# EAGLE design TRV_UP20 (EAGLE 6.4)
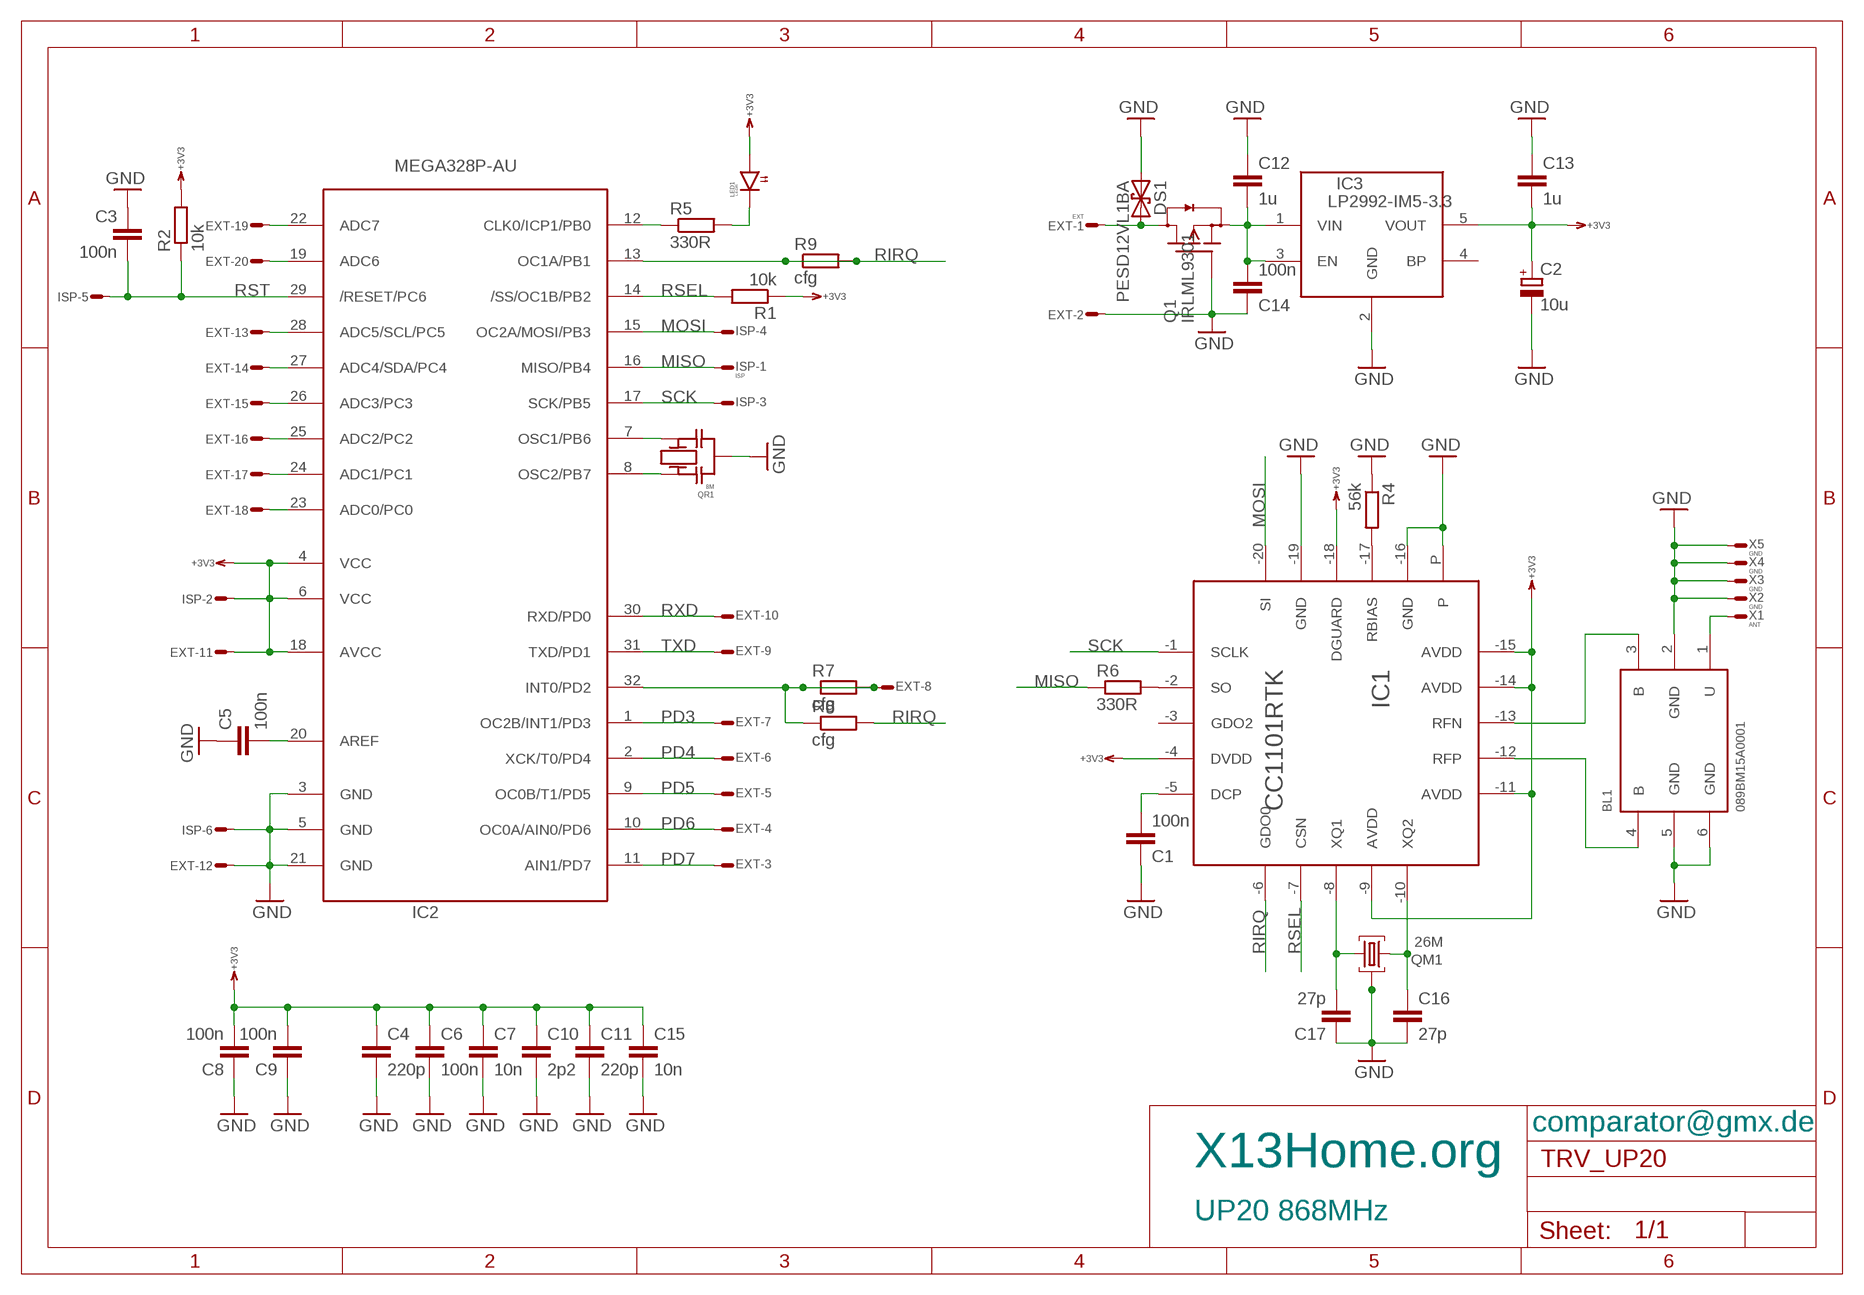
[diagram p0: schematic, sheet 1]

## Parts
BL1  089BM15A0001  BL  [BL]
C1  100n  C0402  [0402]
C2  10u  C_POLSMCB  [SMC_B]
C3  100n  C0603  [0603]
C4  220p  C0402  [0402]
C5  100n  C0603  [0603]
C6  100n  C0402  [0402]
C7  10n  C0402  [0402]
C8  100n  C0603  [0603]
C9  100n  C0603  [0603]
C10  2p2  C0402  [0402]
C11  220p  C0402  [0402]
C12  1u  C0603  [0603]
C13  1u  C0603  [0603]
C14  100n  C0603  [0603]
C15  10n  C0402  [0402]
C16  27p  C0402  [0402]
C17  27p  C0402  [0402]
DS1  PESD12VL1BA  TVS-U323  [SOD323]
EXT  EXT  ML20SE  [ML20S]
IC1  CC1101RTK  CC110L  [VQFN20]
IC2  MEGA328P-AU  MEGA168PA  [TQFP32-08]
IC3  LP2992-IM5-3.3  LDO  [SOT23-5]
ISP  ISP  ML6ES  [ML6S]
LED1  LEDR  LEDT134  [T1-3/4]
Q1  IRLML9301  FET-PDSOT23  [SOT23]
QM1  26M  QM3.2X2.5  [SMD_4P_3.2X2.5]
QR1  8M  QRCE  [CSTCE]
R1  10k  R0402  [0402]
R2  10k  R0603  [0603]
R4  56k  R0402  [0402]
R5  330R  R0402  [0402]
R6  330R  R0402  [0402]
R7  cfg  R0402  [0402]
R8  cfg  R0402  [0402]
R9  cfg  R0402  [0402]
X1  ANT  WIREPADS2.54/1.27  [S2.54/1.27]
X2  GND  WIREPADS2.54/1.27  [S2.54/1.27]
X3  GND  WIREPADS2.54/1.27  [S2.54/1.27]
X4  GND  WIREPADS2.54/1.27  [S2.54/1.27]
X5  GND  WIREPADS2.54/1.27  [S2.54/1.27]

## Nets
+3V3: C2.+ C4.1 C6.1 C7.1 C8.2 C9.2 C10.1 C11.1 C13.2 C15.1 EXT.11 IC1.-4(DVDD) IC1.-9(AVDD) IC1.-11(AVDD) IC1.-14(AVDD) IC1.-15(AVDD) IC1.-18(DGUARD) IC2.4(VCC) IC2.6(VCC) IC2.18(AVCC) IC3.5(VOUT) ISP.2 LED1.A R1.1 R2.2
ADC6: EXT.20 IC2.19(ADC6)
ADC7: EXT.19 IC2.22(ADC7)
GND: BL1.2(GND) BL1.5(GND) BL1.6(GND) C1.1 C2.- C3.1 C4.2 C5.1 C6.2 C7.2 C8.1 C9.1 C10.2 C11.2 C12.1 C13.1 C14.1 C15.2 C16.2 C17.1 DS1.A EXT.2 EXT.12 IC1.-16(GND) IC1.-19(GND) IC1.P IC2.3(GND) IC2.5(GND) IC2.21(GND) IC3.2(GND) ISP.6 Q1.1(G) QM1.2(M1) QM1.4(M2) QR1.G(M) R4.1 X2.1(S) X3.1(S) X4.1(S) X5.1(S)
MISO: IC2.16(MISO/PB4) ISP.1 R6.1
MOSI: IC1.-20(SI) IC2.15(OC2A/MOSI/PB3) ISP.4
N$1: C1.2 IC1.-5(DCP)
N$2: IC1.-17(RBIAS) R4.2
N$4: IC1.-2(SO) R6.2
N$5: DS1.C EXT.1 Q1.3(D)
N$6: C5.2 IC2.20(AREF)
N$7: IC2.8(OSC2/PB7) QR1.A
N$8: IC2.7(OSC1/PB6) QR1.B
N$10: IC2.12(CLK0/ICP1/PB0) R5.1
N$11: EXT.8 IC2.32(INT0/PD2) R7.1 R7.2 R8.1
N$12: C12.2 C14.2 IC3.1(VIN) IC3.3(EN) Q1.2(S)
N$13: BL1.3(B) IC1.-13(RFN)
N$14: BL1.4(B) IC1.-12(RFP)
N$16: BL1.1(U) X1.1(S)
N$17: C17.2 IC1.-8(XQ1) QM1.3
N$18: C16.1 IC1.-10(XQ2) QM1.1
N$21: LED1.C R5.2
PC0: EXT.18 IC2.23(ADC0/PC0)
PC1: EXT.17 IC2.24(ADC1/PC1)
PC2: EXT.16 IC2.25(ADC2/PC2)
PC3: EXT.15 IC2.26(ADC3/PC3)
PC4: EXT.14 IC2.27(ADC4/SDA/PC4)
PC5: EXT.13 IC2.28(ADC5/SCL/PC5)
PD3: EXT.7 IC2.1(OC2B/INT1/PD3)
PD4: EXT.6 IC2.2(XCK/T0/PD4)
PD5: EXT.5 IC2.9(OC0B/T1/PD5)
PD6: EXT.4 IC2.10(OC0A/AIN0/PD6)
PD7: EXT.3 IC2.11(AIN1/PD7)
RIRQ: IC1.-6(GDO0) IC2.13(OC1A/PB1) R8.2 R9.1 R9.2
RSEL: IC1.-7(CSN) IC2.14(/SS/OC1B/PB2) R1.2
RST: C3.2 IC2.29(/RESET/PC6) ISP.5 R2.1
RXD: EXT.10 IC2.30(RXD/PD0)
SCK: IC1.-1(SCLK) IC2.17(SCK/PB5) ISP.3
TXD: EXT.9 IC2.31(TXD/PD1)
Unconnected: IC1.-3(GDO2) IC3.4(BP)

## Notes on the sheet
- comparator@gmx.de
- X13Home.org
- UP20 868MHz

## Library data of the parts
BL1 = RF:BL
C1 C3-C17 = RCL:C: Capacitor SMD
C2 = RCL:C_POL: POLARIZED CAPACITOR, European symbol
DS1 = Diode:TVS-U: DIODE
EXT = Conn:ML20?E: HARTING
IC1 = RF:CC110L
IC2 = atmel:MEGA168P: MCU, 4/8/16k, TQFP32
IC3 = DCDC:LDO
ISP = Conn:ML6E: HARTING
LED1 = Optic:LED
Q1 = Transistor:FET-PD
QM1 = QUARTZ:QM
QR1 = QUARTZ:QR
R1 R2 R4-R9 = RCL:R: Resistor SMD
X1-X5 = Conn:WIREPAD: Wire PAD connect wire on PCB

## Board
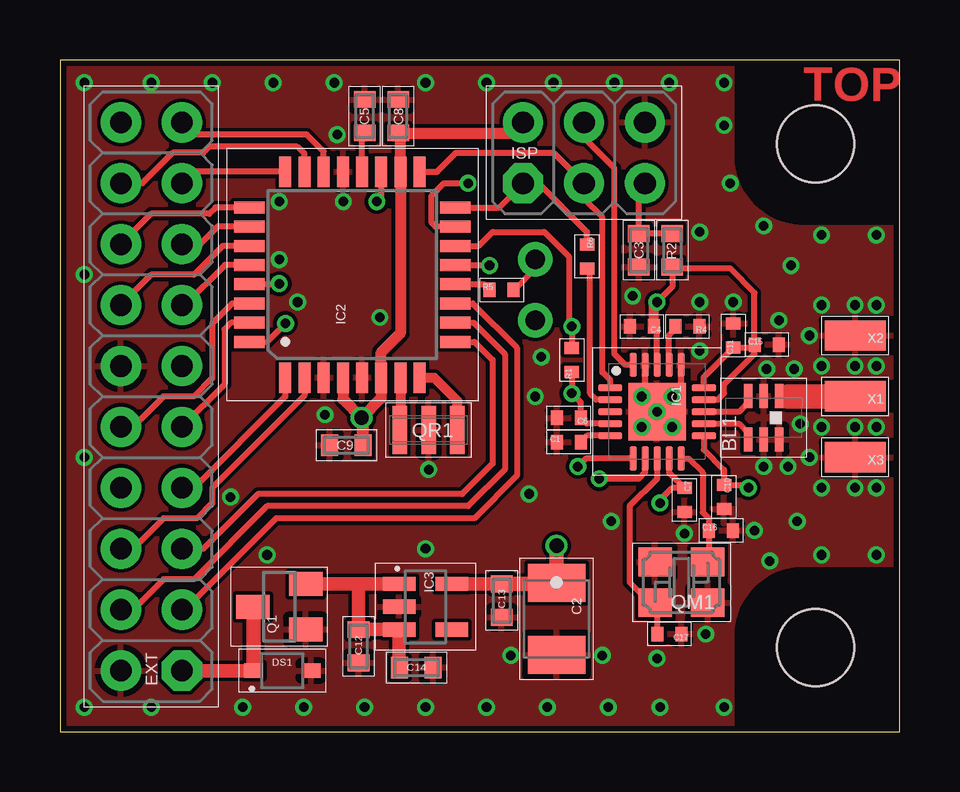
[diagram p1: board, top side]
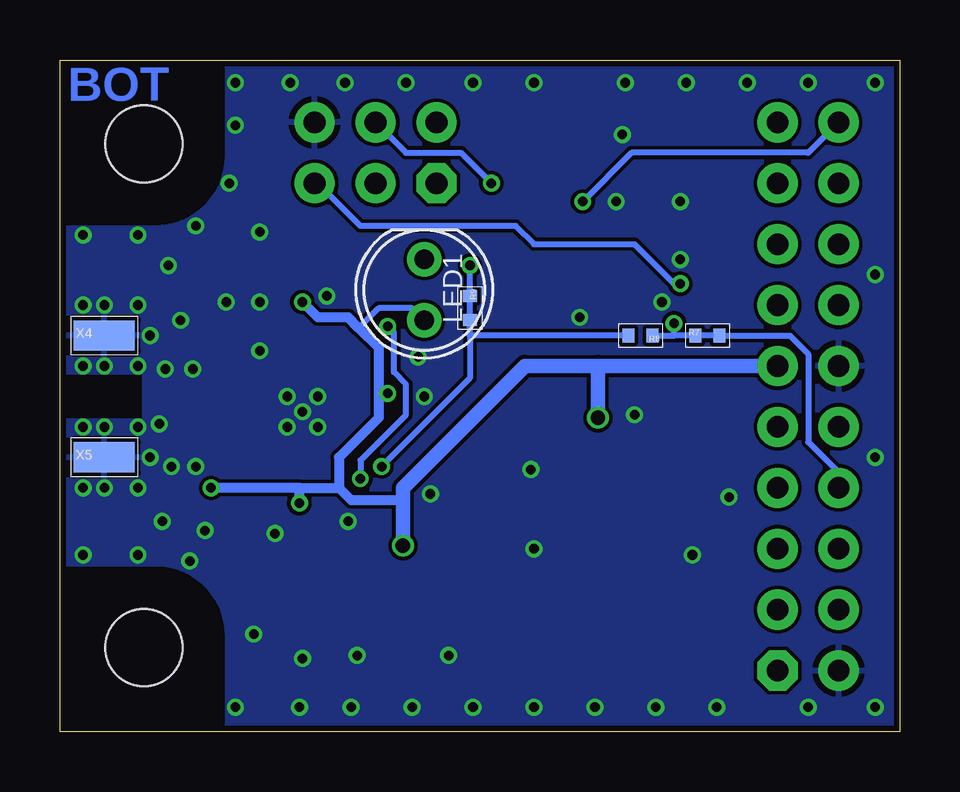
[diagram p2: board, bottom side, seen from below]

Size 35 x 28 mm. Coordinates in mm from the lower left corner, seen from the top.
Outline: 0,0 35,0 35,28 0,28 0,0
Copper layers (1*16): Top 0.035mm / dielectric 1.5mm / Bottom 0.035mm
Design rules "ITEADstudio_DRC *": minimum track width 6mil, minimum drill 12mil, track to track 6mil, track to pad 6mil, pad to pad 6mil, via to via 6mil, smd to smd 0mil, copper to edge 10mil, drill to drill 10mil, minimum pad ring 10mil, minimum via ring 6mil, stop-mask expansion 2mil, vias tented up to drill 100mil, thermal gap 10mil
Holes 3.2 mm at 31.5,24.5 31.5,3.5

### Footprints (pad centres in the part's own frame; a part is rotated, then mirrored left to right if it is on the bottom)
BL = smd 1 x 0.35: 1 0.9,-0.65; 2 0.9,0; 3 0.9,0.65; 4 -0.9,0.65; 5 -0.9,0; 6 -0.9,-0.65
0402 = smd 0.5 x 0.6: 1 -0.5,0; 2 0.5,0
SMC_B = smd 1.6 x 2.4: + -1.5,0; - 1.5,0
0603 = smd 0.7 x 0.9: 1 -0.697,0; 2 0.697,0
SOD323 = smd 0.8 x 0.6: A 1.2,0; C -1.2,0
ML20S = drill 0.9 pad 1.676 octagon: 1 -11.43,-1.27 | drill 0.9 pad 1.676: 2 -11.43,1.27; 3 -8.89,-1.27; 4 -8.89,1.27; 5 -6.35,-1.27; 6 -6.35,1.27; 7 -3.81,-1.27; 8 -3.81,1.27; 9 -1.27,-1.27; 10 -1.27,1.27; 11 1.27,-1.27; 12 1.27,1.27; 13 3.81,-1.27; 14 3.81,1.27; 15 6.35,-1.27; 16 6.35,1.27; 17 8.89,-1.27; 18 8.89,1.27; 19 11.43,-1.27; 20 11.43,1.27
VQFN20 = smd 0.28 x 1: -1 -1,-1.95; -2 -0.5,-1.95; -3 0,-1.95; -4 0.5,-1.95; -5 1,-1.95; -11 1,1.95; -12 0.5,1.95; -13 0,1.95; -14 -0.5,1.95; -15 -1,1.95 | smd 1 x 0.28: -6 1.95,-1; -7 1.95,-0.5; -8 1.95,0; -9 1.95,0.5; -10 1.95,1; -16 -1.95,1; -17 -1.95,0.5; -18 -1.95,0; -19 -1.95,-0.5; -20 -1.95,-1 | smd 2.4 x 2.4: P 0,0
TQFP32-08 = smd 1.27 x 0.5: 1 -4.293,2.8; 2 -4.293,2; 3 -4.293,1.2; 4 -4.293,0.4; 5 -4.293,-0.4; 6 -4.293,-1.2; 7 -4.293,-2; 8 -4.293,-2.8; 17 4.293,-2.8; 18 4.293,-2; 19 4.293,-1.2; 20 4.293,-0.4; 21 4.293,0.4; 22 4.293,1.2; 23 4.293,2; 24 4.293,2.8 | smd 0.5 x 1.27: 9 -2.8,-4.293; 10 -2,-4.293; 11 -1.2,-4.293; 12 -0.4,-4.293; 13 0.4,-4.293; 14 1.2,-4.293; 15 2,-4.293; 16 2.8,-4.293; 25 2.8,4.293; 26 2,4.293; 27 1.2,4.293; 28 0.4,4.293; 29 -0.4,4.293; 30 -1.2,4.293; 31 -2,4.293; 32 -2.8,4.293
SOT23-5 = smd 0.6 x 1.35: 1 -0.95,-1.101; 2 0,-1.101; 3 0.95,-1.101; 4 0.95,1.101; 5 -0.951,1.101
ML6S = drill 0.9 pad 1.676 octagon: 1 -2.54,-1.27 | drill 0.9 pad 1.676: 2 -2.54,1.27; 3 0,-1.27; 4 0,1.27; 5 2.54,-1.27; 6 2.54,1.27
T1-3/4 = drill 0.8 pad 1.422: A 1.27,0; C -1.27,0
SOT23 = smd 1 x 1.4: 1 -0.95,-1.1; 2 0.95,-1.1; 3 0,1.1
SMD_4P_3.2X2.5 = smd 1.4 x 1.2: 1 -1.1,-0.85; 2 1.1,-0.85; 3 1.1,0.85; 4 -1.1,0.85
CSTCE = smd 0.6 x 2: A -1.2,0; B 1.2,0; G 0,0
S2.54/1.27 = smd 1.27 x 2.54: 1 0,0

### Placement (x,y rotation side)
BL1  29.34,13.08 90 top
C1  21.21,12.06 0 top
C2  20.7,4.7 270 top
C3  24.13,20.07 90 top
C4  24.26,16.89 180 top
C5  12.7,25.65 270 top
C6  21.21,13.08 180 top
C7  26.04,9.65 270 top
C8  14.1,25.65 270 top
C9  11.94,11.94 0 top
C10  27.69,9.78 270 top
C11  28.07,16.51 90 top
C12  12.45,3.56 90 top
C13  18.41,5.46 90 top
C14  14.86,2.67 180 top
C15  29.46,16.13 0 top
C16  27.56,8.38 0 top
C17  25.4,4.06 180 top
DS1  9.27,2.54 0 top
EXT  3.81,13.97 90 top
IC1  24.89,13.34 270 top
IC2  12.19,19.05 90 top
IC3  15.24,5.21 270 top
ISP  21.84,24.13 0 top
LED1  19.81,18.41 270 bottom
Q1  9.14,5.21 90 top
QM1  25.91,6.22 180 top
QR1  15.37,12.57 180 top
R1  21.34,15.49 90 top
R2  25.53,20.07 270 top
R4  26.16,16.89 180 top
R5  18.41,18.41 0 top
R6  21.97,19.81 270 top
R7  8,16.51 0 bottom
R8  10.79,16.51 180 bottom
R9  17.91,17.65 270 bottom
X1  33.15,13.97 90 top
X2  33.15,16.51 90 top
X3  33.15,11.43 90 top
X4  33.15,16.51 270 bottom
X5  33.15,11.43 270 bottom

### Tracks (layer width: path | path; a pad name or v marks a point on that pad's centre or on a via)
+3V3  (via drill 0.4, 0.6)
  Top 0.254: IC1.-4 21.95,12.84 C6.1 21.71,13.72 v21.34,14.1 R1.1 | IC1.-18 24.89,16.76 C4.1 | IC1.-14 27.42,13.84 27.69,14.1 27.69,14.48 28.96,15.75 C15.1 | IC1.-11 26.84,11.76 27.69,10.91 C10.1 28.58,10.28 v28.7,10.16 | v25.02,9.53 25.02,9.65 25.52,10.15 C7.1 25.39,10.79 IC1.-9 | v24.89,17.91 25.53,18.54 R2.2 25.59,19.3 27.94,19.3 28.96,18.29 C15.1 | C15.1 28.84,16.01 C11.1 26.84,14.78 IC1.-15 | C15.1
  Top 0.406: C4.1 24.76,17.77 v24.89,17.91
  Top 0.457: ISP.2 18.86,24.96 C8.2 14.19,24.86 IC2.18 14.19,16.61 13.39,15.8 IC2.6 13.39,13.9 v12.57,13.08 11.79,13.86 IC2.4
  Top 0.508: C9.2 12.63,13.02 v12.57,13.08
  Top 0.559: IC3.5 C13.2
  Top 0.61: C13.2 20.66,6.16 C2.+ v20.7,7.75
  Bottom 0.254: 22.54,16.83 21.72,17.65 20.32,17.65 LED1.A
  Bottom 0.406: v21.34,14.1 21.72,14.1 | 25.02,10.16 v28.7,10.16 | v25.02,9.53 25.02,10.16 | 21.72,14.1 C6.1 23.37,11.43 23.37,10.16 | 23.37,10.16 22.86,9.65 20.7,9.65 | 25.02,10.16 23.37,10.16 | v24.89,17.91 24.26,17.27 22.99,17.27 22.54,16.83 21.72,16 21.72,14.1
  Bottom 0.61: 12.57,15.24 EXT.11 | v12.57,13.08 12.57,15.24 | 12.57,15.24 15.62,15.24 20.7,10.16 20.7,9.65 v20.7,7.75
ADC6  (via drill 0.4)
  Top 0.254: IC2.19 13.39,22.28 v13.21,22.1
  Bottom 0.254: EXT.20 3.81,24.13 11.18,24.13 v13.21,22.1
ADC7
  Top 0.254: IC2.22 10.99,24.19 10.29,24.89 5.59,24.89 EXT.19
GND  (via drill 0.4, 0.4 pad 0.61)
  Top 0.254: IC1.-19 24.39,13.84 IC1.P | IC1.-16 25.89,14.49
  other vias: 29.34,11.05 23.88,18.16 24.89,13.34 24.26,13.97 25.53,13.97 24.26,12.7 25.53,12.7 31.75,12.7 33.15,12.7 34.04,12.7 34.04,15.24 33.15,15.24 31.75,15.24 33.15,17.78 34.04,17.78 34.04,20.7 26.67,15.88 26.67,17.91 27.94,22.86 28.07,17.91 31.24,16.51 31.75,20.7 34.04,10.16 33.15,10.16 31.75,10.16 31.24,11.43 30.73,8.76 28.96,8.38 26.04,8.26 27.69,27.05 25.4,27.05 23.11,27.05 20.57,27.05 17.78,27.05 15.24,27.05 11.43,27.05 11.56,24.89 8.89,27.05 6.35,27.05 3.81,27.05 1.02,27.05 1.02,19.05 1.02,11.43 1.02,1.02 34.04,7.37 31.75,7.37 29.59,7.11 26.92,4.06 24.89,3.05 25.02,1.02 22.86,1.02 20.32,1.02 15.24,1.02 12.7,1.02 10.16,1.02 7.62,1.02 3.81,1.02 22.61,3.17 15.24,7.62 8.64,7.37 7.11,9.78 11.05,13.21 15.37,10.92 13.34,17.27 9.91,17.91 11.81,22.1 9.14,22.1 9.14,19.68 27.69,1.02 18.8,3.17 17.78,1.02 27.69,25.27 29.46,15.11 30.61,15.11 31.75,17.78 30.86,12.83 29.34,21.08 19.56,9.91 22.99,8.76 26.67,20.83 30.48,19.43 30.35,11.05 29.97,17.14 19.81,13.97 20.07,15.62
  pour Top: 0,0 28,0 28,4 arc-90 31,7 35,7 35,21 31,21 arc-90 28,24 28,28 0,28
  pour Bottom: 0,0 28,0 28,4 arc-90 31,7 35,7 35,12.95 31.45,12.95 31.45,14.99 35,14.99 35,21 31,21 arc-90 28,24 28,28 0,28
MISO
  Top 0.254: R6.1 21.97,20.83 19.94,22.86 ISP.1 18.29,21.85 IC2.16
MOSI  (via drill 0.4)
  Top 0.254: ISP.4 21.84,24.77 23.11,23.5 23.11,15.75 23.58,15.29 IC1.-20 | IC2.15 15.65,21.05 15.49,21.21 15.49,22.35 16,22.86 v17.02,22.86
  Bottom 0.254: ISP.4 20.57,24.13 18.29,24.13 v17.02,22.86
N$1
  Top 0.254: IC1.-5 21.98,12.34 C1.2
N$2
  Top 0.254: IC1.-17 25.39,16.5 25.65,16.76 R4.2
N$4
  Top 0.254: IC1.-2 22.36,13.84 22.1,14.1 22.1,19.18 R6.2
N$5
  Top 0.559: EXT.1 DS1.C
  Top 0.61: DS1.C 8.07,5.18 Q1.3
N$6
  Top 0.254: IC2.20 12.59,24.85 C5.2
N$7
  Top 0.406: IC2.8 15.6,14.76 16.57,13.79 QR1.A
N$8
  Top 0.406: IC2.7 14.19,12.6 QR1.B
N$10
  Top 0.254: IC2.12 17.68,18.65 R5.1
N$11  (via drill 0.4)
  Top 0.254: IC2.32 8.63,16.25 v9.4,17.02
  Bottom 0.254: EXT.8 2.54,10.79 3.81,12.06 3.81,15.75 4.57,16.51 R7.2 R7.1 9.4,16.51 | R8.1 9.4,16.51 | 9.4,16.51 v9.4,17.02
N$12
  Top 0.559: IC3.1 12.45,6.16 | 12.45,6.16 Q1.2 | Q1.2 | 12.45,6.16 C12.2 IC3.3 14.14,2.69 C14.2
N$13
  Top 0.254: IC1.-13 28.32,13.34 28.7,13.72 28.7,13.97 BL1.3
N$14
  Top 0.254: IC1.-12 28.31,12.84 28.7,12.45 28.7,12.2 BL1.4
N$16
  Top 0.254: BL1.1 30.34,13.98 30.35,13.97
  Top 1.016: 30.35,13.97 X1.1
N$17
  Top 0.254: IC1.-8 24.89,10.54 23.75,9.4 23.75,6.22 24.64,5.33 24.77,5.33 | 24.77,5.33 QM1.3 | C17.2 24.9,5.2 24.77,5.33
N$18
  Top 0.254: IC1.-10 26.21,11.38 26.8,10.79 26.8,9.14 27.05,8.89 C16.1 | C16.1 | C16.1 27.05,7.12 QM1.1
N$21
  Top 0.254: R5.2 18.92,18.41 19.81,19.3 LED1.C
PC0
  Top 0.254: IC2.23 10.19,24.1 9.91,24.38 6.22,24.38 5.97,24.13 4.7,24.13 3.43,22.86 EXT.18
PC1
  Top 0.254: IC2.24 5.56,23.34 EXT.17
PC2
  Top 0.254: IC2.25 6.48,21.85 6.22,21.59 3.81,21.59 EXT.16
PC3
  Top 0.254: IC2.26 6.57,21.05 5.84,20.32 EXT.15
PC4
  Top 0.254: IC2.27 6.79,20.25 5.59,19.05 3.81,19.05 EXT.14
PC5
  Top 0.254: IC2.28 6.88,19.45 5.21,17.78 EXT.13
PD3
  Top 0.254: IC2.1 9.39,13.96 5.59,10.16 EXT.7
PD4
  Top 0.254: EXT.6 3.05,7.62 4.32,8.89 5.71,8.89 6.35,9.53 6.35,10.16 10.19,14 IC2.2
PD5
  Top 0.254: IC2.9 17.28,16.25 18.03,15.49 18.03,11.18 16.76,9.91 8.26,9.91 5.97,7.62 EXT.5
PD6
  Top 0.254: IC2.10 17.24,17.05 18.54,15.75 18.54,10.92 17.02,9.4 8.64,9.4 5.59,6.35 4.32,6.35 3.05,5.08 EXT.4
PD7
  Top 0.254: IC2.11 17.2,17.85 19.05,16 19.05,10.67 17.27,8.89 9.02,8.89 5.21,5.08 EXT.3
RIRQ  (via drill 0.4)
  Top 0.254: IC1.-6 21.93,11.38 v21.59,11.05 | IC2.13 17.89,19.45 v17.91,19.43
  Bottom 0.254: v17.91,19.43 R9.1 R9.2 17.91,16.51 | 17.91,16.51 17.91,14.73 v21.59,11.05 | R8.2 17.91,16.51
RSEL  (via drill 0.4)
  Top 0.254: IC1.-7 24.39,10.8 24.13,10.54 v22.48,10.54 | R1.2 v21.34,16.89 21.21,17.02 21.21,19.81 20.19,20.83 18.03,20.83 17.46,20.25 IC2.14
  Bottom 0.254: v22.48,10.54 22.48,11.3 20.57,13.21 20.57,14.48 21.08,14.99 21.08,16.64 v21.34,16.89
RST  (via drill 0.4)
  Top 0.254: IC2.29 9.12,18.65 v9.14,18.67 | R2.1 C3.2 24.13,22.61 ISP.5
  Bottom 0.254: v9.14,18.67 9.4,18.67 11.05,20.32 15.24,20.32 16,21.08 22.48,21.08 24.26,22.86 ISP.5
RXD
  Top 0.254: EXT.10 3.05,12.7 4.32,13.97 5.59,13.97 6.35,14.73 6.35,17.02 7.18,17.85 IC2.30
SCK
  Top 0.254: IC1.-1 22.94,14.65 22.61,14.99 22.61,21.46 21.84,22.23 ISP.3 20.57,24.13 16.51,24.13 15.72,23.34 IC2.17
TXD
  Top 0.254: IC2.31 7.14,17.05 6.86,16.76 6.86,14.48 EXT.9

### Text on the board
Top: TOP
Bottom: BOT
Document: ISP | 3V3 | X13Home.org | + | UP20